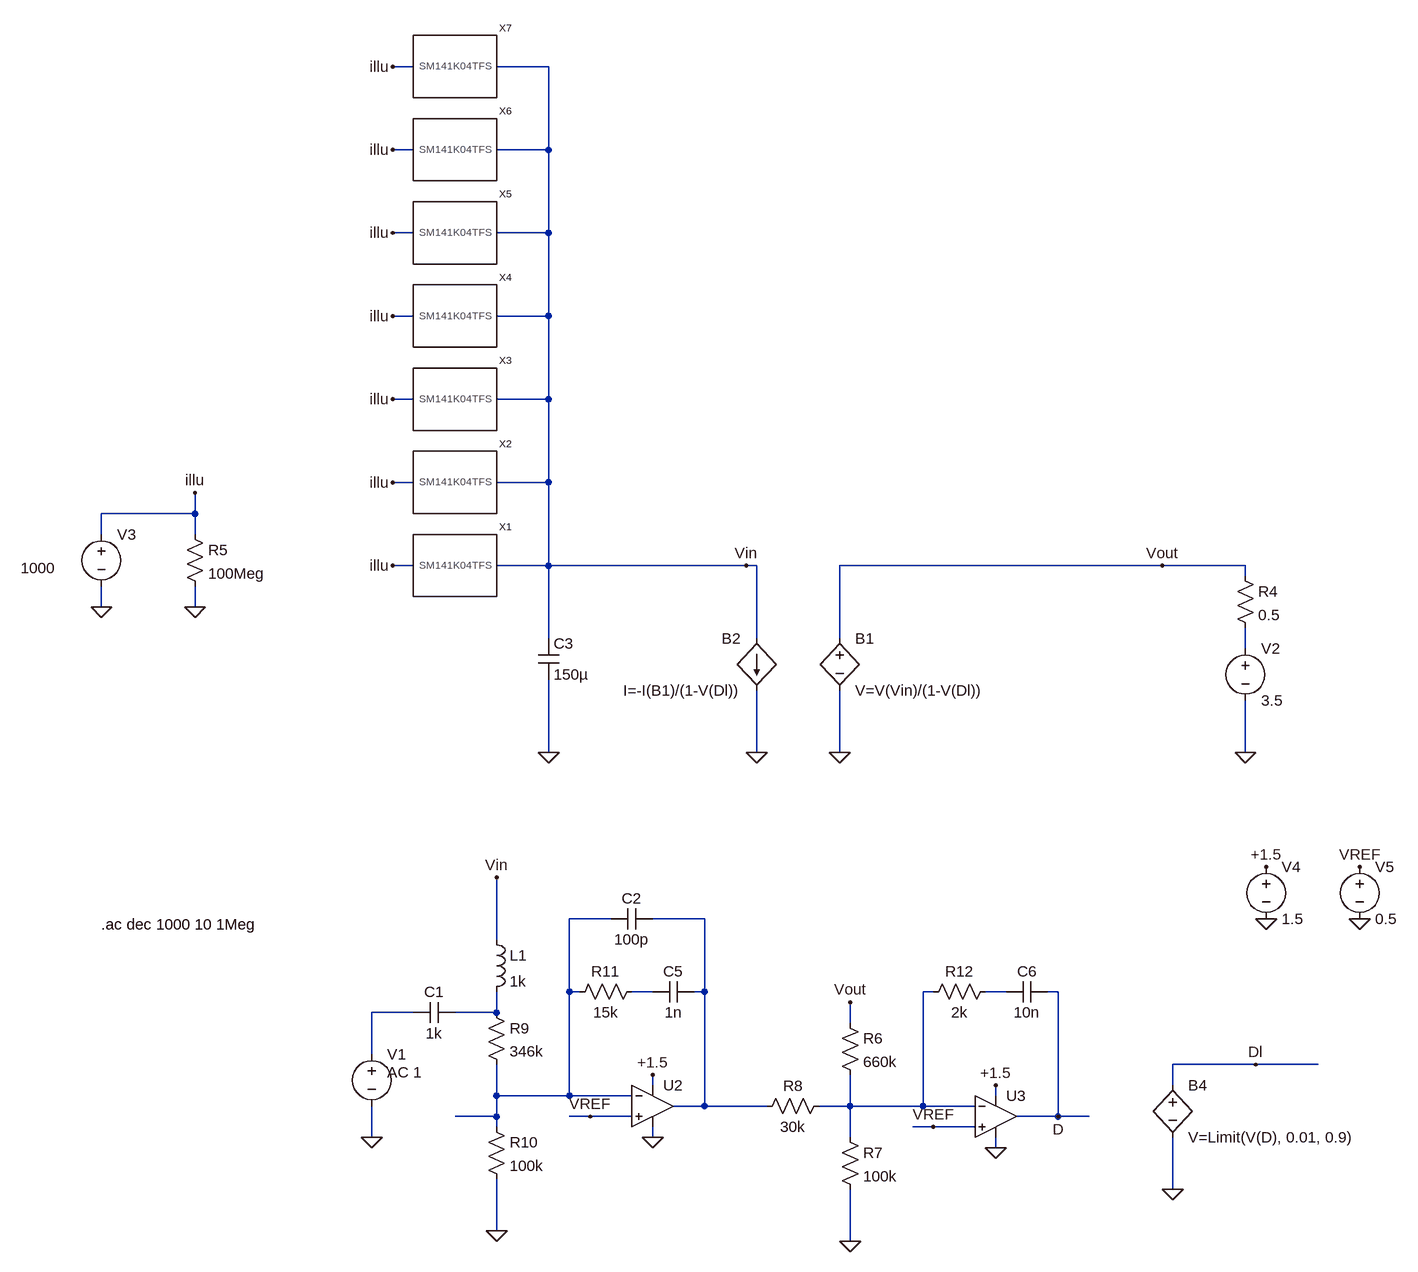
[diagram p0: schematic Draft5.asc]
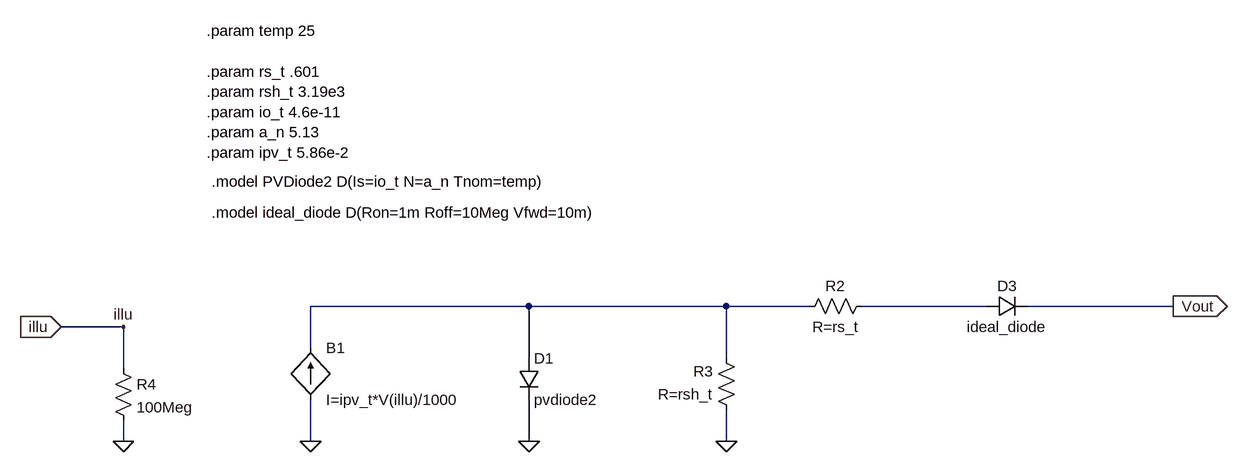
[diagram p1: sub-circuit sm141k04tfs.asc]
Draft5.asc, the LTspice schematic file:
Version 4
SHEET 1 1984 724
WIRE 128 -1488 96 -1488
WIRE 336 -1488 256 -1488
WIRE 128 -1360 96 -1360
WIRE 336 -1360 336 -1488
WIRE 336 -1360 256 -1360
WIRE 128 -1232 96 -1232
WIRE 336 -1232 336 -1360
WIRE 336 -1232 256 -1232
WIRE 128 -1104 96 -1104
WIRE 336 -1104 336 -1232
WIRE 336 -1104 256 -1104
WIRE 128 -976 96 -976
WIRE 336 -976 336 -1104
WIRE 336 -976 256 -976
WIRE 128 -848 96 -848
WIRE 336 -848 336 -976
WIRE 336 -848 256 -848
WIRE -208 -800 -208 -832
WIRE -208 -800 -352 -800
WIRE -352 -768 -352 -800
WIRE -208 -768 -208 -800
WIRE 128 -720 96 -720
WIRE 336 -720 336 -848
WIRE 336 -720 256 -720
WIRE 640 -720 336 -720
WIRE 656 -720 640 -720
WIRE 1280 -720 784 -720
WIRE 1408 -720 1280 -720
WIRE 1408 -704 1408 -720
WIRE -352 -656 -352 -688
WIRE -208 -656 -208 -688
WIRE 336 -608 336 -720
WIRE 656 -608 656 -720
WIRE 784 -608 784 -720
WIRE 1408 -592 1408 -624
WIRE 336 -432 336 -544
WIRE 656 -432 656 -528
WIRE 784 -432 784 -528
WIRE 1408 -432 1408 -512
WIRE 432 -176 368 -176
WIRE 576 -176 496 -176
WIRE 256 -144 256 -240
WIRE 368 -64 368 -176
WIRE 384 -64 368 -64
WIRE 496 -64 464 -64
WIRE 576 -64 576 -176
WIRE 576 -64 560 -64
WIRE 928 -64 912 -64
WIRE 1040 -64 1008 -64
WIRE 1120 -64 1104 -64
WIRE 128 -32 64 -32
WIRE 256 -32 256 -64
WIRE 256 -32 192 -32
WIRE 800 -16 800 -48
WIRE 64 32 64 -32
WIRE 1424 48 1296 48
WIRE 1520 48 1424 48
WIRE 496 80 496 64
WIRE 1296 80 1296 48
WIRE 256 96 256 48
WIRE 368 96 368 -64
WIRE 368 96 256 96
WIRE 464 96 368 96
WIRE 1024 96 1024 80
WIRE 576 112 576 -64
WIRE 576 112 528 112
WIRE 672 112 576 112
WIRE 800 112 800 64
WIRE 800 112 752 112
WIRE 912 112 912 -64
WIRE 912 112 800 112
WIRE 992 112 912 112
WIRE 256 128 256 96
WIRE 256 128 192 128
WIRE 400 128 368 128
WIRE 464 128 400 128
WIRE 1120 128 1120 -64
WIRE 1120 128 1056 128
WIRE 1168 128 1120 128
WIRE 256 144 256 128
WIRE 928 144 896 144
WIRE 992 144 928 144
WIRE 64 160 64 112
WIRE 496 160 496 144
WIRE 800 160 800 112
WIRE 1024 176 1024 160
WIRE 1296 240 1296 160
WIRE 256 304 256 224
WIRE 800 320 800 240
FLAG 640 -720 Vin
FLAG 784 -432 0
FLAG 1280 -720 Vout
FLAG 1408 -432 0
FLAG 656 -432 0
FLAG -208 -832 illu
FLAG -208 -656 0
FLAG -352 -656 0
FLAG 96 -720 illu
FLAG 336 -432 0
FLAG 96 -848 illu
FLAG 96 -976 illu
FLAG 96 -1104 illu
FLAG 96 -1232 illu
FLAG 96 -1360 illu
FLAG 96 -1488 illu
FLAG 1440 -176 0
FLAG 1440 -256 +1.5
FLAG 1584 -176 0
FLAG 1584 -256 VREF
FLAG 496 160 0
FLAG 496 64 +1.5
FLAG 1024 176 0
FLAG 1024 80 +1.5
FLAG 1120 128 D
FLAG 800 320 0
FLAG 800 -48 Vout
FLAG 1296 240 0
FLAG 1424 48 Dl
FLAG 256 304 0
FLAG 256 -240 Vin
FLAG 400 128 VREF
FLAG 928 144 VREF
FLAG 64 160 0
SYMBOL bv 784 -624 R0
SYMATTR InstName B1
SYMATTR Value V=V(Vin)/(1-V(Dl))
SYMBOL bi 656 -608 M0
SYMATTR InstName B2
SYMATTR Value I=-I(B1)/(1-V(Dl))
SYMBOL Voltage 1408 -608 R0
SYMATTR InstName V2
SYMATTR Value 3.5
SYMBOL Res 1392 -720 R0
SYMATTR InstName R4
SYMATTR Value 0.5
SYMBOL SM141K04TFS 192 -720 R0
SYMATTR InstName X1
SYMBOL res -224 -784 R0
SYMATTR InstName R5
SYMATTR Value 100Meg
SYMBOL voltage -352 -784 R0
WINDOW 3 -124 68 Left 2
WINDOW 123 0 0 Left 0
WINDOW 39 0 0 Left 0
SYMATTR InstName V3
SYMATTR Value 1000
SYMBOL cap 320 -608 R0
SYMATTR InstName C3
SYMATTR Value 150µ
SYMATTR SpiceLine Rser=10m
SYMBOL SM141K04TFS 192 -848 R0
SYMATTR InstName X2
SYMBOL SM141K04TFS 192 -976 R0
SYMATTR InstName X3
SYMBOL SM141K04TFS 192 -1104 R0
SYMATTR InstName X4
SYMBOL SM141K04TFS 192 -1232 R0
SYMATTR InstName X5
SYMBOL SM141K04TFS 192 -1360 R0
SYMATTR InstName X6
SYMBOL SM141K04TFS 192 -1488 R0
SYMATTR InstName X7
SYMBOL Voltage 1440 -272 R0
SYMATTR InstName V4
SYMATTR Value 1.5
SYMBOL Voltage 1584 -272 R0
WINDOW 123 0 0 Left 0
WINDOW 39 0 0 Left 0
SYMATTR InstName V5
SYMATTR Value 0.5
SYMBOL OpAmps/UniversalOpAmp2 496 112 R0
SYMATTR InstName U2
SYMBOL OpAmps/UniversalOpAmp2 1024 128 R0
SYMATTR InstName U3
SYMBOL Res 784 -32 R0
SYMATTR InstName R6
SYMATTR Value 660k
SYMBOL Res 784 144 R0
SYMATTR InstName R7
SYMATTR Value 100k
SYMBOL bv 1296 64 R0
SYMATTR InstName B4
SYMATTR Value V=Limit(V(D), 0.01, 0.9)
SYMBOL Res 768 96 R90
WINDOW 0 0 56 VBottom 2
WINDOW 3 32 56 VTop 2
SYMATTR InstName R8
SYMATTR Value 30k
SYMBOL Res 240 -48 R0
SYMATTR InstName R9
SYMATTR Value 346k
SYMBOL Res 240 128 R0
SYMATTR InstName R10
SYMATTR Value 100k
SYMBOL res 480 -80 R90
WINDOW 0 0 56 VBottom 2
WINDOW 3 32 56 VTop 2
SYMATTR InstName R11
SYMATTR Value 15k
SYMBOL cap 560 -80 R90
WINDOW 0 0 32 VBottom 2
WINDOW 3 32 32 VTop 2
SYMATTR InstName C5
SYMATTR Value 1n
SYMBOL res 1024 -80 R90
WINDOW 0 0 56 VBottom 2
WINDOW 3 32 56 VTop 2
SYMATTR InstName R12
SYMATTR Value 2k
SYMBOL cap 1104 -80 R90
WINDOW 0 0 32 VBottom 2
WINDOW 3 32 32 VTop 2
SYMATTR InstName C6
SYMATTR Value 10n
SYMBOL ind 240 -160 R0
SYMATTR InstName L1
SYMATTR Value 1k
SYMBOL cap 192 -48 R90
WINDOW 0 0 32 VBottom 2
WINDOW 3 32 32 VTop 2
SYMATTR InstName C1
SYMATTR Value 1k
SYMBOL voltage 64 16 R0
WINDOW 123 24 44 Left 2
WINDOW 39 0 0 Left 0
SYMATTR InstName V1
SYMATTR Value ""
SYMATTR Value2 AC 1
SYMBOL cap 496 -192 R90
WINDOW 0 0 32 VBottom 2
WINDOW 3 32 32 VTop 2
SYMATTR InstName C2
SYMATTR Value 100p
TEXT -352 -168 Left 2 !.ac dec 1000 10 1Meg

sm141k04tfs.asc, the sub-circuit schematic file:
Version 4
SHEET 1 1228 692
WIRE 64 80 -272 80
WIRE 368 80 64 80
WIRE 496 80 368 80
WIRE 768 80 576 80
WIRE 1056 80 832 80
WIRE -560 112 -656 112
WIRE -272 144 -272 80
WIRE 64 160 64 80
WIRE 368 160 368 80
WIRE -560 176 -560 112
WIRE -560 288 -560 256
WIRE -272 288 -272 224
WIRE 64 288 64 224
WIRE 368 288 368 240
FLAG 368 288 0
FLAG 64 288 0
FLAG -272 288 0
FLAG 1056 80 Vout
IOPIN 1056 80 Out
FLAG -656 112 illu
IOPIN -656 112 In
FLAG -560 112 illu
FLAG -560 288 0
SYMBOL res 592 64 R90
WINDOW 0 0 56 VBottom 2
WINDOW 3 32 56 VTop 2
SYMATTR InstName R2
SYMATTR Value R=rs_t
SYMBOL res 384 256 R180
WINDOW 0 36 76 Left 2
WINDOW 3 36 40 Left 2
SYMATTR InstName R3
SYMATTR Value R=rsh_t
SYMBOL diode 48 160 R0
SYMATTR InstName D1
SYMATTR Value pvdiode2
SYMBOL bi2 -272 144 R0
SYMATTR InstName B1
SYMATTR Value I=ipv_t*V(illu)/1000
SYMBOL diode 768 96 R270
WINDOW 0 32 32 VTop 2
WINDOW 3 0 32 VBottom 2
SYMATTR InstName D3
SYMATTR Value ideal_diode
SYMBOL res -576 160 R0
SYMATTR InstName R4
SYMATTR Value 100Meg
TEXT -424 -112 Left 2 !.model PVDiode2 D(Is=io_t N=a_n Tnom=temp)
TEXT -432 -344 Left 2 !.param temp 25\n \n.param rs_t .601\n.param rsh_t 3.19e3\n.param io_t 4.6e-11\n.param a_n 5.13\n.param ipv_t 5.86e-2
TEXT -424 -64 Left 2 !.model ideal_diode D(Ron=1m Roff=10Meg Vfwd=10m)

The netlist it stands for:
* Draft5.asc
B1 Vout 0 V=V(Vin)/(1-V(Dl))
B2 Vin 0 I=-I(B1)/(1-V(Dl))
V2 N001 0 3.5
R4 Vout N001 0.5
XX1 illu Vin sm141k04tfs
R5 illu 0 100Meg
V3 illu 0 1000
C3 Vin 0 150µ Rser=10m
XX2 illu Vin sm141k04tfs
XX3 illu Vin sm141k04tfs
XX4 illu Vin sm141k04tfs
XX5 illu Vin sm141k04tfs
XX6 illu Vin sm141k04tfs
XX7 illu Vin sm141k04tfs
V4 +1.5 0 1.5
V5 VREF 0 0.5
XU2 VREF N002 +1.5 0 N003 level2 Avol=1Meg GBW=10Meg Slew=10Meg Ilimit=25m Rail=0 Vos=0 En=0 Enk=0 In=0 Ink=0 Rin=500Meg  ; pins In+ In- V+ V- OUT
XU3 VREF N005 +1.5 0 D level2 Avol=1Meg GBW=10Meg Slew=10Meg Ilimit=25m Rail=0 Vos=0 En=0 Enk=0 In=0 Ink=0 Rin=500Meg  ; pins In+ In- V+ V- OUT
R6 Vout N005 660k
R7 N005 0 100k
B4 Dl 0 V=Limit(V(D), 0.01, 0.9)
R8 N005 N003 30k
R9 N008 N002 346k
R10 N002 0 100k
R11 N004 N002 15k
C5 N003 N004 1n
R12 N006 N005 2k
C6 D N006 10n
L1 Vin N008 1k
C1 N008 N007 1k
V1 N007 0 AC 1
C2 N003 N002 100p

* block symbol definitions
.subckt sm141k04tfs Illu Vout
R2 N002 N001 R=rs_t
R3 0 N001 R=rsh_t
D1 N001 0 pvdiode2
B1 0 N001 I=ipv_t*V(illu)/1000
D3 N002 Vout ideal_diode
R4 illu 0 100Meg
.model PVDiode2 D(Is=io_t N=a_n Tnom=temp)
.param temp 25
.param rs_t .601
.param rsh_t 3.19e3
.param io_t 4.6e-11
.param a_n 5.13
.param ipv_t 5.86e-2
.model ideal_diode D(Ron=1m Roff=10Meg Vfwd=10m)
.ends sm141k04tfs

.model D D
.lib standard.dio
.ac dec 1000 10 1Meg
.lib UniversalOpAmp2.lib
.backanno
.end